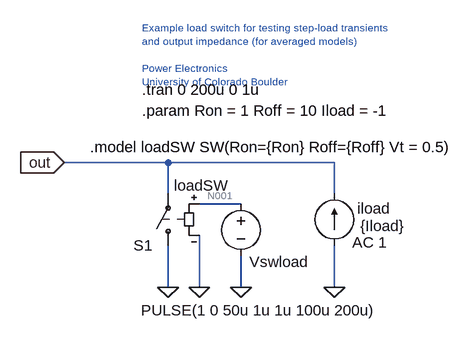
[diagram p0: schematic load.asc]
load.asc, the LTspice schematic file:
Version 4
SHEET 1 880 680
WIRE -80 -112 -240 -112
WIRE 176 -112 -80 -112
WIRE -80 -64 -80 -112
WIRE 176 -64 176 -112
WIRE 32 -48 -32 -48
WIRE -80 80 -80 16
WIRE -32 80 -32 0
WIRE 32 80 32 32
WIRE 176 80 176 16
FLAG -80 80 0
FLAG 176 80 0
FLAG -32 80 0
FLAG 32 80 0
FLAG -240 -112 out
IOPIN -240 -112 In
SYMBOL current 176 16 R180
WINDOW 0 -86 57 Left 2
WINDOW 3 -109 30 Left 2
WINDOW 123 -81 5 Left 2
WINDOW 39 0 0 Left 2
SYMATTR InstName iload
SYMATTR Value {Iload}
SYMATTR Value2 AC 1
SYMBOL sw -80 32 R180
WINDOW 3 -93 109 Left 2
SYMATTR Value loadSW
SYMATTR InstName S1
SYMBOL voltage 32 -64 R0
WINDOW 123 0 0 Left 2
WINDOW 39 0 0 Left 2
WINDOW 3 -154 180 Left 2
WINDOW 0 13 105 Left 2
SYMATTR Value PULSE(1 0 50u 1u 1u 100u 200u)
SYMATTR InstName Vswload
TEXT -200 -136 Left 2 !.model loadSW SW(Ron={Ron} Roff={Roff} Vt = 0.5)
TEXT -120 -320 Left 1 ;Example load switch for testing step-load transients\nand output impedance (for averaged models)\n \nPower Electronics \nUniversity of Colorado Boulder
TEXT -120 -192 Left 2 !.param Ron = 1 Roff = 10 Iload = -1
TEXT -120 -224 Left 2 !.tran 0 200u 0 1u

The netlist it stands for:
* load.asc
iload 0 out {Iload} AC 1
S1 0 out N001 0 loadSW
Vswload N001 0 PULSE(1 0 50u 1u 1u 100u 200u)
.model loadSW SW(Ron={Ron} Roff={Roff} Vt = 0.5)
* Example load switch for testing step-load transients
* and output impedance (for averaged models)
* Power Electronics
* University of Colorado Boulder
.param Ron = 1 Roff = 10 Iload = -1
.tran 0 200u 0 1u
.backanno
.end

* Results of the author's LTspice run, read from the files saved beside the schematic
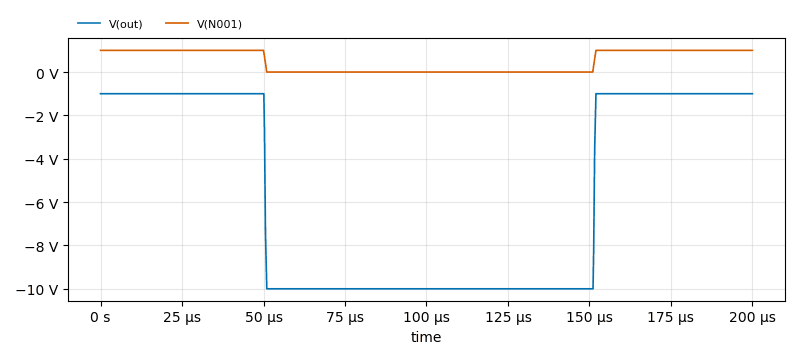
[diagram p1: Transient Analysis of load.asc, plotted from the saved traces]
* Transient Analysis, 1 run:
*   V(out): min -10 V, max -1 V, average -5.545 V, rms 7.135 V, last -1 V
*   V(N001): min 0 V, max 1 V, average 495 mV, rms 702.5 mV, last 1 V